# Altium schematic sheet DAC Board TOP.SchDoc
size A3
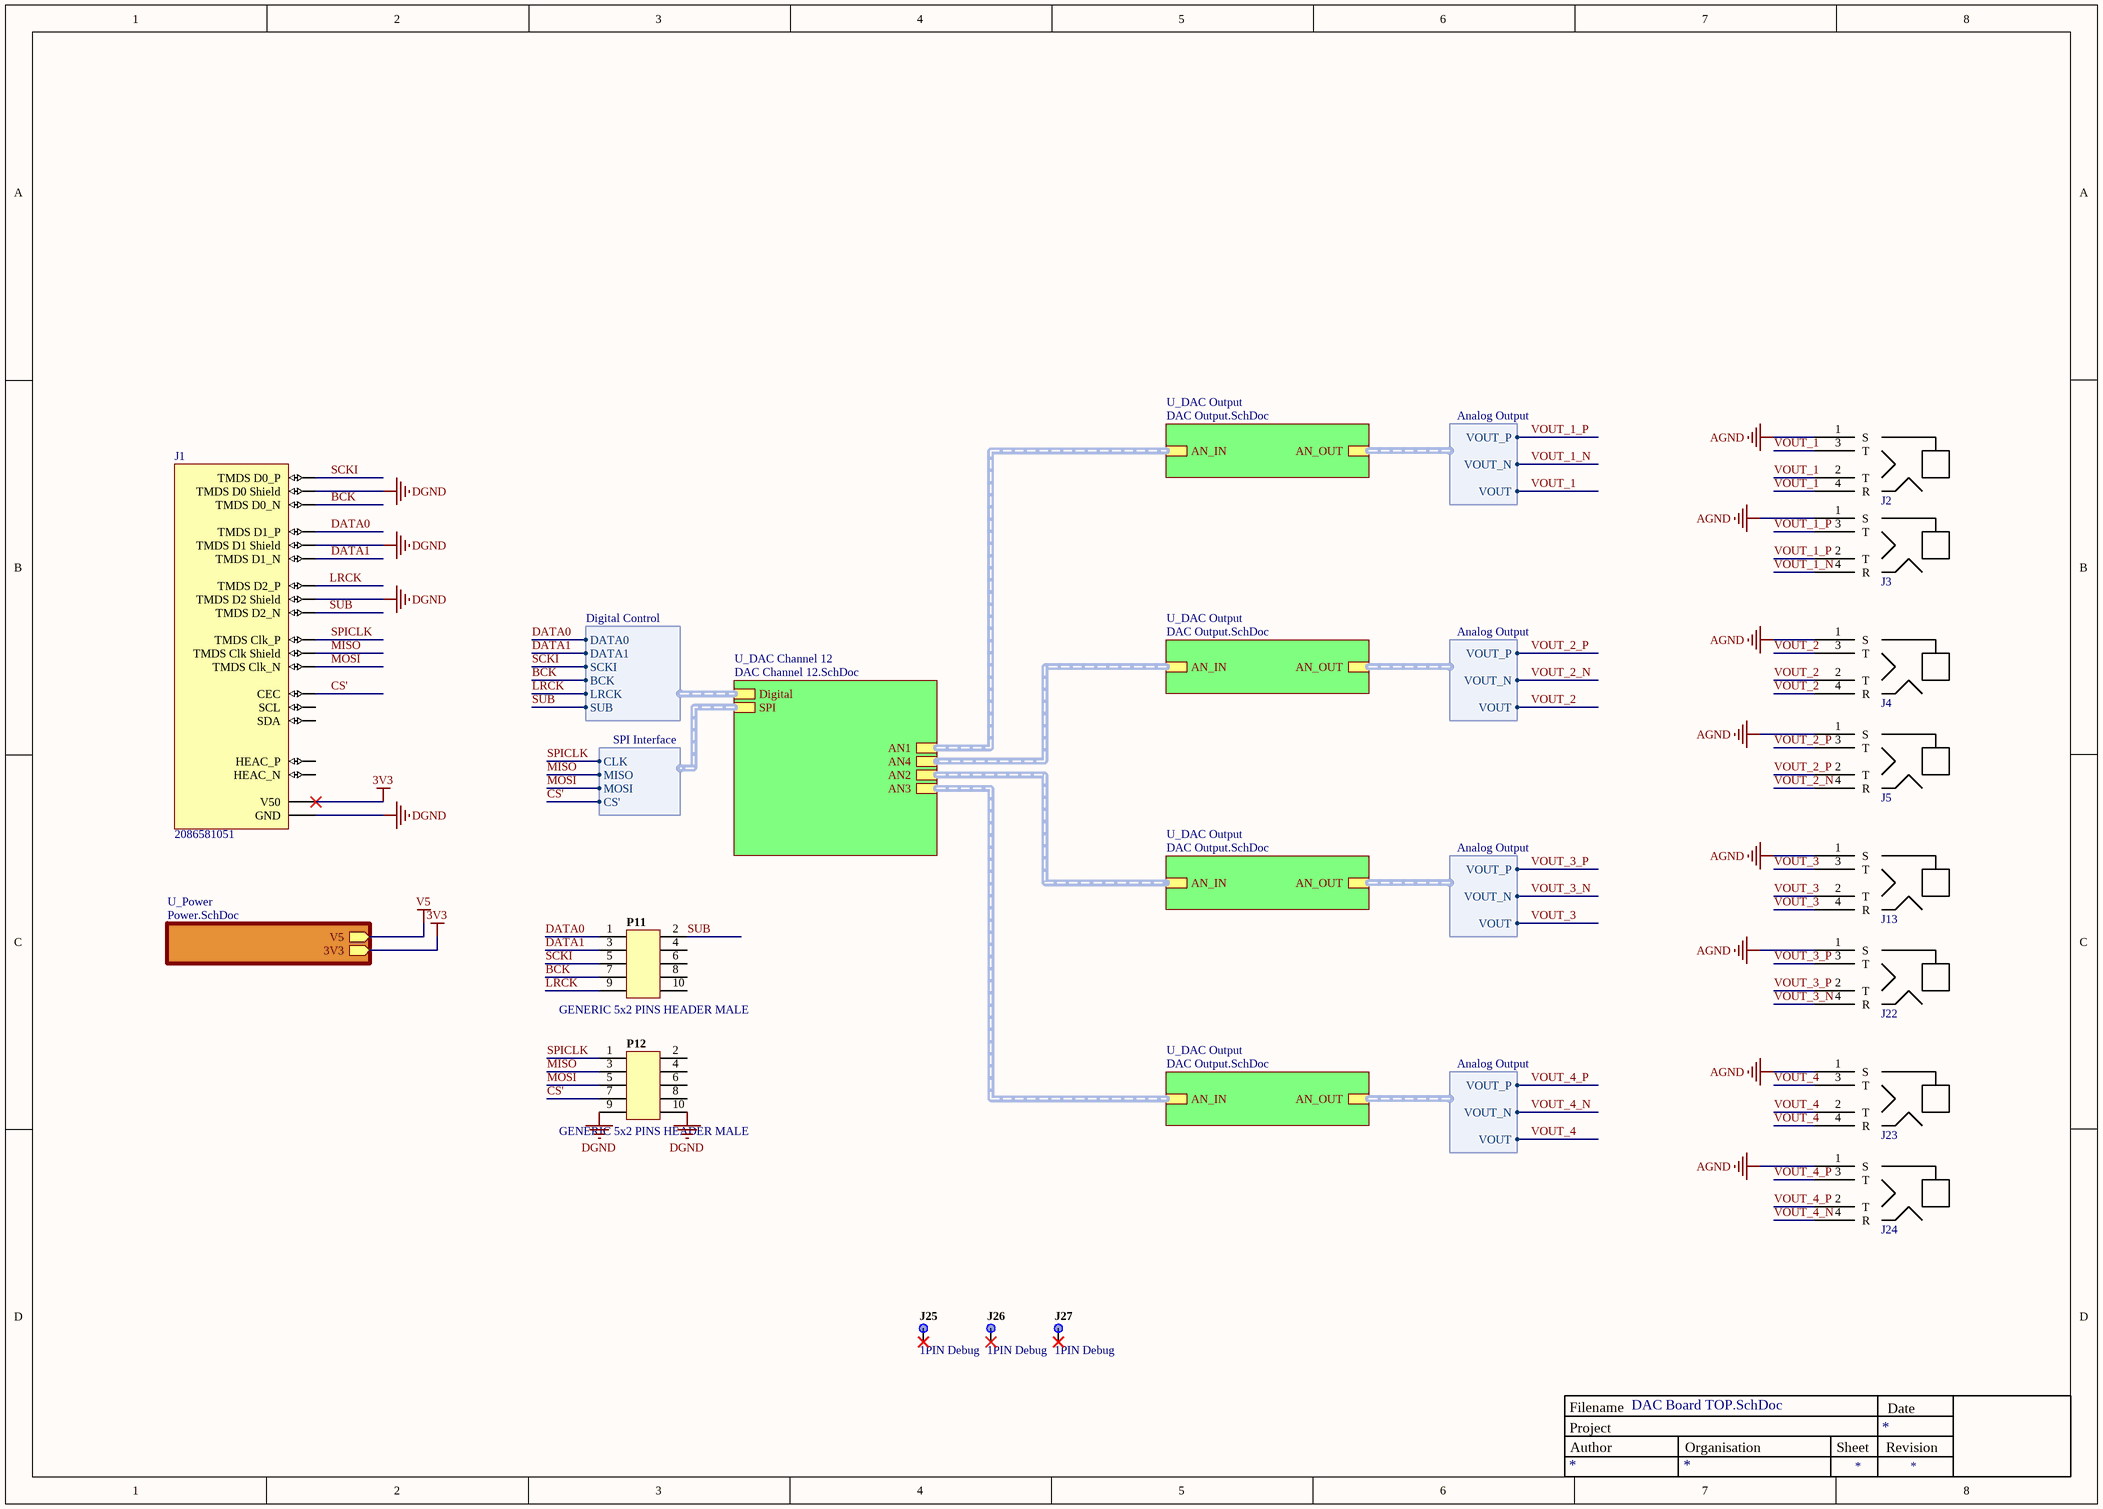
[diagram p0: DAC Board TOP.SchDoc]

## Parts
J1  2086581051  [2086581051]
J2  SJ1-2503A  [SJ1-2503A-Footprint-1]  (value not drawn)
J3  SJ1-2503A  [SJ1-2503A-Footprint-1]  (value not drawn)
J4  SJ1-2503A  [SJ1-2503A-Footprint-1]  (value not drawn)
J5  SJ1-2503A  [SJ1-2503A-Footprint-1]  (value not drawn)
J13  SJ1-2503A  [SJ1-2503A-Footprint-1]  (value not drawn)
J22  SJ1-2503A  [SJ1-2503A-Footprint-1]  (value not drawn)
J23  SJ1-2503A  [SJ1-2503A-Footprint-1]  (value not drawn)
J24  SJ1-2503A  [SJ1-2503A-Footprint-1]  (value not drawn)
J25  1PIN Debug  [1 Pin Debug Port 0.9mm]
J26  1PIN Debug  [1 Pin Debug Port 0.9mm]
J27  1PIN Debug  [1 Pin Debug Port 0.9mm]
P11  GENERIC 5x2 PINS HEADER MALE  [GENERIC 5PIN 2ROW HEADER 0]
P12  GENERIC 5x2 PINS HEADER MALE  [GENERIC 5PIN 2ROW HEADER 0]

## Sub-sheets
U_DAC Channel 12 = DAC Channel 12.SchDoc: SPI (harness SPI Interface), AN1 (harness Analog Input), AN4 (harness Analog Input), AN2 (harness Analog Input), AN3 (harness Analog Input), Digital (harness Digital Control)
U_DAC Output = DAC Output.SchDoc: AN_IN (harness Analog Input), AN_OUT (harness Analog Output)
U_DAC Output = DAC Output.SchDoc: AN_IN (harness Analog Input), AN_OUT (harness Analog Output)
U_DAC Output = DAC Output.SchDoc: AN_IN (harness Analog Input), AN_OUT (harness Analog Output)
U_DAC Output = DAC Output.SchDoc: AN_IN (harness Analog Input), AN_OUT (harness Analog Output)
U_Power = Power.SchDoc: V5 (out), 3V3 (out)

## Harnesses
Analog Output: VOUT_P, VOUT_N, VOUT
Digital Control: DATA0, DATA1, SCKI, BCK, LRCK, SUB
SPI Interface: CLK, MISO, MOSI, CS'

## Nets
3V3: J1.18(V50) ; sheet U_Power/3V3
AGND: J2.1(S) J3.1(S) J4.1(S) J5.1(S) J13.1(S) J22.1(S) J23.1(S) J24.1(S)
DGND: J1.2(TMDS_D2_Shield) J1.5(TMDS_D1_Shield) J1.8(TMDS_D0_Shield) J1.17(GND) P12.9 P12.10
V5: sheet U_Power/V5
BCK: J1.9(TMDS_D0_N) P11.7 ; sheet U_DAC Channel 12/Digital.BCK
CS': J1.13(CEC) P12.7 ; sheet U_DAC Channel 12/SPI.CS'
DATA0: J1.4(TMDS_D1_P) P11.1 ; sheet U_DAC Channel 12/Digital.DATA0
DATA1: J1.6(TMDS_D1_N) P11.3 ; sheet U_DAC Channel 12/Digital.DATA1
LRCK: J1.1(TMDS_D2_P) P11.9 ; sheet U_DAC Channel 12/Digital.LRCK
MISO: J1.11(TMDS_Clk_Shield) P12.3 ; sheet U_DAC Channel 12/SPI.MISO
MOSI: J1.12(TMDS_Clk_N) P12.5 ; sheet U_DAC Channel 12/SPI.MOSI
SCKI: J1.7(TMDS_D0_P) P11.5 ; sheet U_DAC Channel 12/Digital.SCKI
SPICLK: J1.10(TMDS_Clk_P) P12.1 ; sheet U_DAC Channel 12/SPI.CLK
SUB: J1.3(TMDS_D2_N) P11.2 ; sheet U_DAC Channel 12/Digital.SUB
VOUT_1: J2.2(T) J2.3(T) J2.4(R) ; sheet U_DAC Output/AN_OUT.VOUT
VOUT_1_N: J3.4(R) ; sheet U_DAC Output/AN_OUT.VOUT_N
VOUT_1_P: J3.2(T) J3.3(T) ; sheet U_DAC Output/AN_OUT.VOUT_P
VOUT_2: J4.2(T) J4.3(T) J4.4(R) ; sheet U_DAC Output/AN_OUT.VOUT
VOUT_2_N: J5.4(R) ; sheet U_DAC Output/AN_OUT.VOUT_N
VOUT_2_P: J5.2(T) J5.3(T) ; sheet U_DAC Output/AN_OUT.VOUT_P
VOUT_3: J13.2(T) J13.3(T) J13.4(R) ; sheet U_DAC Output/AN_OUT.VOUT
VOUT_3_N: J22.4(R) ; sheet U_DAC Output/AN_OUT.VOUT_N
VOUT_3_P: J22.2(T) J22.3(T) ; sheet U_DAC Output/AN_OUT.VOUT_P
VOUT_4: J23.2(T) J23.3(T) J23.4(R) ; sheet U_DAC Output/AN_OUT.VOUT
VOUT_4_N: J24.4(R) ; sheet U_DAC Output/AN_OUT.VOUT_N
VOUT_4_P: J24.2(T) J24.3(T) ; sheet U_DAC Output/AN_OUT.VOUT_P

Not connected (* = marked no-connect by the designer): J1 14(HEAC_P) 15(SCL) 16(SDA) 19(HEAC_N); J25 1*; J26 1*; J27 1*; P11 4 6 8 10; P12 2 4 6 8

## Buses and harness runs
harness sheet U_DAC Channel 12/AN1 = sheet U_DAC Output/AN_IN
harness sheet U_DAC Channel 12/AN2 = sheet U_DAC Output/AN_IN
harness sheet U_DAC Channel 12/AN3 = sheet U_DAC Output/AN_IN
harness sheet U_DAC Channel 12/AN4 = sheet U_DAC Output/AN_IN

## Notes on the sheet
- Project
- Filename
- Author
- Organisation
- Sheet
- Revision
- Date
  Date

## Library data of the parts
J1 = 2086581051-2: CONN FEM SMD 19 90Deg HDMI; Manufacturer: Molex; Status: Active; Supplier 1: Mouser; Source: Connector Library.SchLib; Design Item ID: 2086581051; Bin: *; Supplier Part Number 1: Mouser; Type: HYBRID; Case/Package: 4 PIN
J2-J5 J13 J22-J24 = SJ1-2503A-1: CONN JACK STEREO 2.5MM R/A; Shielding: Unshielded; Number of Ports: 1; Current Rating: 1A; Body Material: Brass; Number of Conductors: 3; Gender: Female; Connector Type: Jack; Diameter: 2.5mm; Color: Black; Packaging: Bulk; Mount: Through Hole; Lead Free: Lead Free; Orientation: Horizontal; Termination: Solder; Contact Plating: Tin
J25-J27 = 1PIN Debug-2: CONN MAL TH 1 0Deg HEADER; Status: NC; Case/Package: 1 PIN; Source: Connector Library.SchLib; Type: N/A; Design Item ID: 1PIN Debug
P11 P12 = GENERIC 5x2 PINS HEADER MALE-2: CONN MAL TH 5x2 0Deg HEADER; Bin: B3-J5; Status: Active; Case/Package: 2 PIN; Source: Connector Library.SchLib; Type: TH; Design Item ID: GENERIC 5x2 PINS HEADER MALE; Manufacturer: Generic